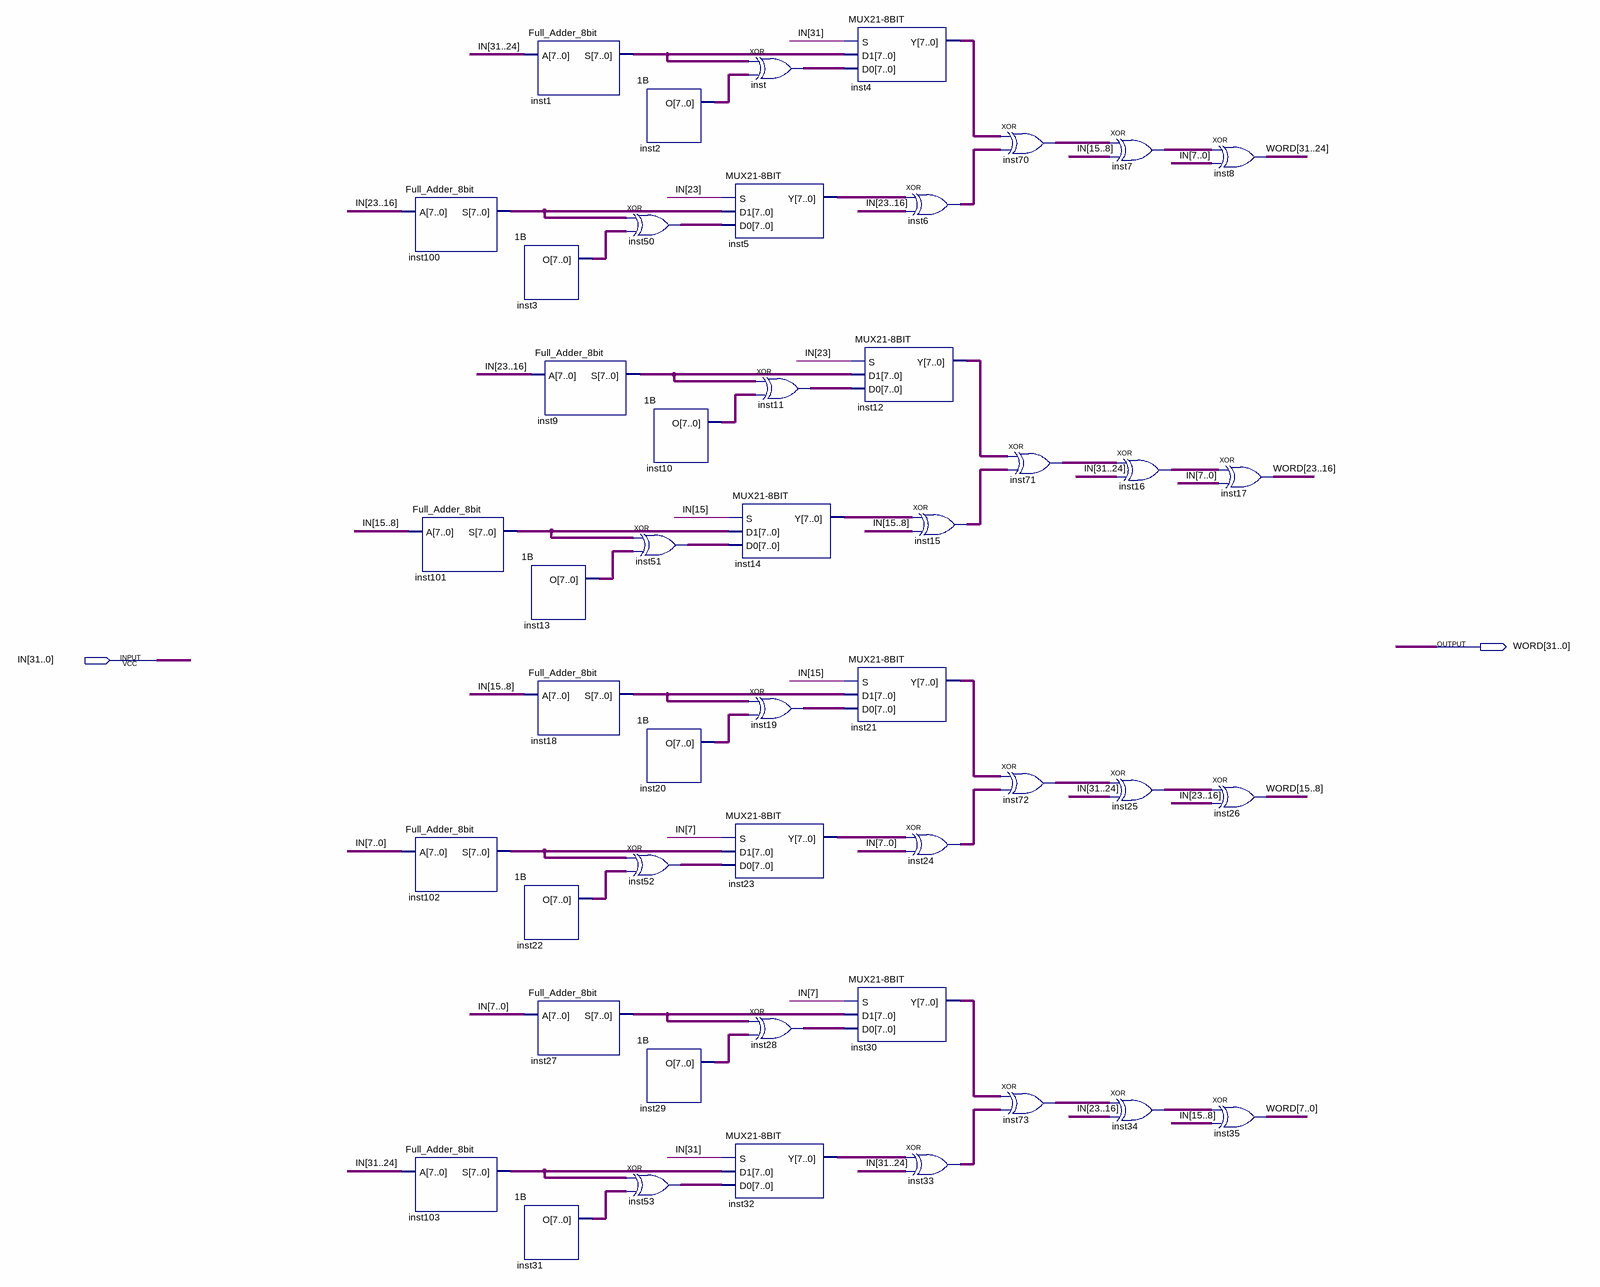
[diagram p0: schematic sheet]
// Quartus schematic ChangeColumn.bdf as structural Verilog: 48 symbols, 2 pins
module ChangeColumn (
  input  [31:0] IN,
  output [31:0] WORD
);

  wire [7:0] inst1_s, inst2_o, inst3_o, inst4_y, inst5_y, inst6_out, inst7_out, inst9_s, inst10_o,
       inst11_out, inst12_y, inst13_o, inst14_y, inst15_out, inst16_out, inst18_s, inst19_out, inst20_o,
       inst21_y, inst22_o, inst23_y, inst24_out, inst25_out, inst27_s, inst28_out, inst29_o, inst30_y,
       inst31_o, inst32_y, inst33_out, inst34_out, inst50_out, inst51_out, inst52_out, inst53_out,
       inst70_out, inst71_out, inst72_out, inst73_out, inst100_s, inst101_s, inst102_s, inst103_s, inst_out;

  Full_Adder_8bit inst100 (.A(IN[23:16]), .S(inst100_s));
  Full_Adder_8bit inst102 (.A(IN[7:0]), .S(inst102_s));
  Full_Adder_8bit inst103 (.A(IN[31:24]), .S(inst103_s));
  Full_Adder_8bit inst101 (.A(IN[15:8]), .S(inst101_s));
  \1B  inst3 (.O(inst3_o));
  \1B  inst22 (.O(inst22_o));
  \1B  inst31 (.O(inst31_o));
  Full_Adder_8bit inst1 (.A(IN[31:24]), .S(inst1_s));
  Full_Adder_8bit inst9 (.A(IN[23:16]), .S(inst9_s));
  \1B  inst13 (.O(inst13_o));
  Full_Adder_8bit inst18 (.A(IN[15:8]), .S(inst18_s));
  Full_Adder_8bit inst27 (.A(IN[7:0]), .S(inst27_s));
  \1B  inst2 (.O(inst2_o));
  assign inst50_out = inst100_s ^ inst3_o;  // XOR inst50, 8 bits wide
  \1B  inst10 (.O(inst10_o));
  assign inst51_out = inst101_s ^ inst13_o;  // XOR inst51, 8 bits wide
  \1B  inst20 (.O(inst20_o));
  assign inst52_out = inst102_s ^ inst22_o;  // XOR inst52, 8 bits wide
  \1B  inst29 (.O(inst29_o));
  assign inst53_out = inst103_s ^ inst31_o;  // XOR inst53, 8 bits wide
  \MUX21-8BIT  inst5 (.S(IN[23]), .D1(inst100_s), .D0(inst50_out), .Y(inst5_y));
  \MUX21-8BIT  inst14 (.S(IN[15]), .D1(inst101_s), .D0(inst51_out), .Y(inst14_y));
  \MUX21-8BIT  inst23 (.S(IN[7]), .D1(inst102_s), .D0(inst52_out), .Y(inst23_y));
  \MUX21-8BIT  inst32 (.S(IN[31]), .D1(inst103_s), .D0(inst53_out), .Y(inst32_y));
  assign inst_out = inst1_s ^ inst2_o;  // XOR inst, 8 bits wide
  assign inst11_out = inst9_s ^ inst10_o;  // XOR inst11, 8 bits wide
  assign inst19_out = inst18_s ^ inst20_o;  // XOR inst19, 8 bits wide
  assign inst28_out = inst27_s ^ inst29_o;  // XOR inst28, 8 bits wide
  \MUX21-8BIT  inst4 (.S(IN[31]), .D1(inst1_s), .D0(inst_out), .Y(inst4_y));
  \MUX21-8BIT  inst12 (.S(IN[23]), .D1(inst9_s), .D0(inst11_out), .Y(inst12_y));
  \MUX21-8BIT  inst21 (.S(IN[15]), .D1(inst18_s), .D0(inst19_out), .Y(inst21_y));
  \MUX21-8BIT  inst30 (.S(IN[7]), .D1(inst27_s), .D0(inst28_out), .Y(inst30_y));
  assign inst6_out = inst5_y ^ IN[23:16];  // XOR inst6, 8 bits wide
  assign inst15_out = inst14_y ^ IN[15:8];  // XOR inst15, 8 bits wide
  assign inst24_out = inst23_y ^ IN[7:0];  // XOR inst24, 8 bits wide
  assign inst33_out = inst32_y ^ IN[31:24];  // XOR inst33, 8 bits wide
  assign inst70_out = inst4_y ^ inst6_out;  // XOR inst70, 8 bits wide
  assign inst72_out = inst21_y ^ inst24_out;  // XOR inst72, 8 bits wide
  assign inst73_out = inst30_y ^ inst33_out;  // XOR inst73, 8 bits wide
  assign inst71_out = inst12_y ^ inst15_out;  // XOR inst71, 8 bits wide
  assign inst7_out = inst70_out ^ IN[15:8];  // XOR inst7, 8 bits wide
  assign inst25_out = inst72_out ^ IN[31:24];  // XOR inst25, 8 bits wide
  assign inst34_out = inst73_out ^ IN[23:16];  // XOR inst34, 8 bits wide
  assign inst16_out = inst71_out ^ IN[31:24];  // XOR inst16, 8 bits wide
  assign WORD[31:24] = inst7_out ^ IN[7:0];  // XOR inst8, 8 bits wide
  assign WORD[23:16] = inst16_out ^ IN[7:0];  // XOR inst17, 8 bits wide
  assign WORD[15:8] = inst25_out ^ IN[23:16];  // XOR inst26, 8 bits wide
  assign WORD[7:0] = inst34_out ^ IN[15:8];  // XOR inst35, 8 bits wide
endmodule
